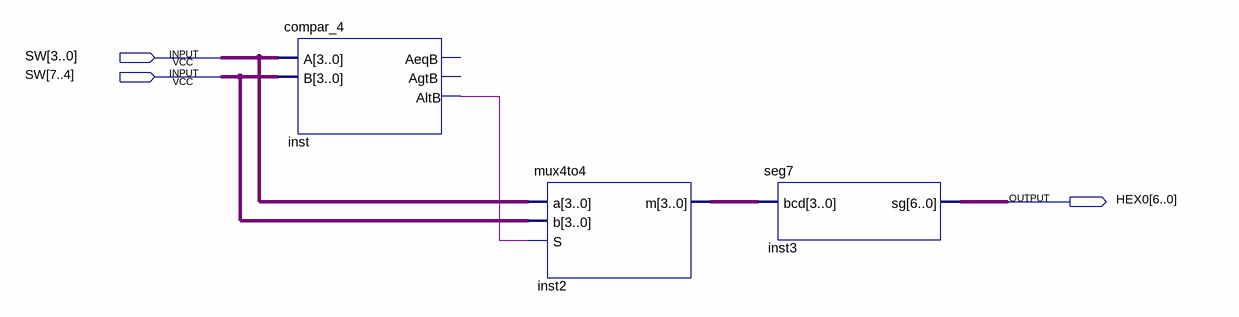
[diagram p0: schematic sheet]
// Quartus schematic Selector_B.bdf as structural Verilog: 3 symbols, 3 pins
module Selector_B (
  input  [7:0] SW,
  output [6:0] HEX0
);

  wire inst_altb;
  wire [3:0] inst2_m;

  compar_4 inst (.A(SW[3:0]), .B(SW[7:4]), .AltB(inst_altb));  // open: AeqB, AgtB
  mux4to4 inst2 (.a(SW[3:0]), .b(SW[7:4]), .S(inst_altb), .m(inst2_m));
  seg7 inst3 (.bcd(inst2_m), .sg(HEX0));
endmodule
